# Altium project Task_2.PrjPcb (part 2 of 5)
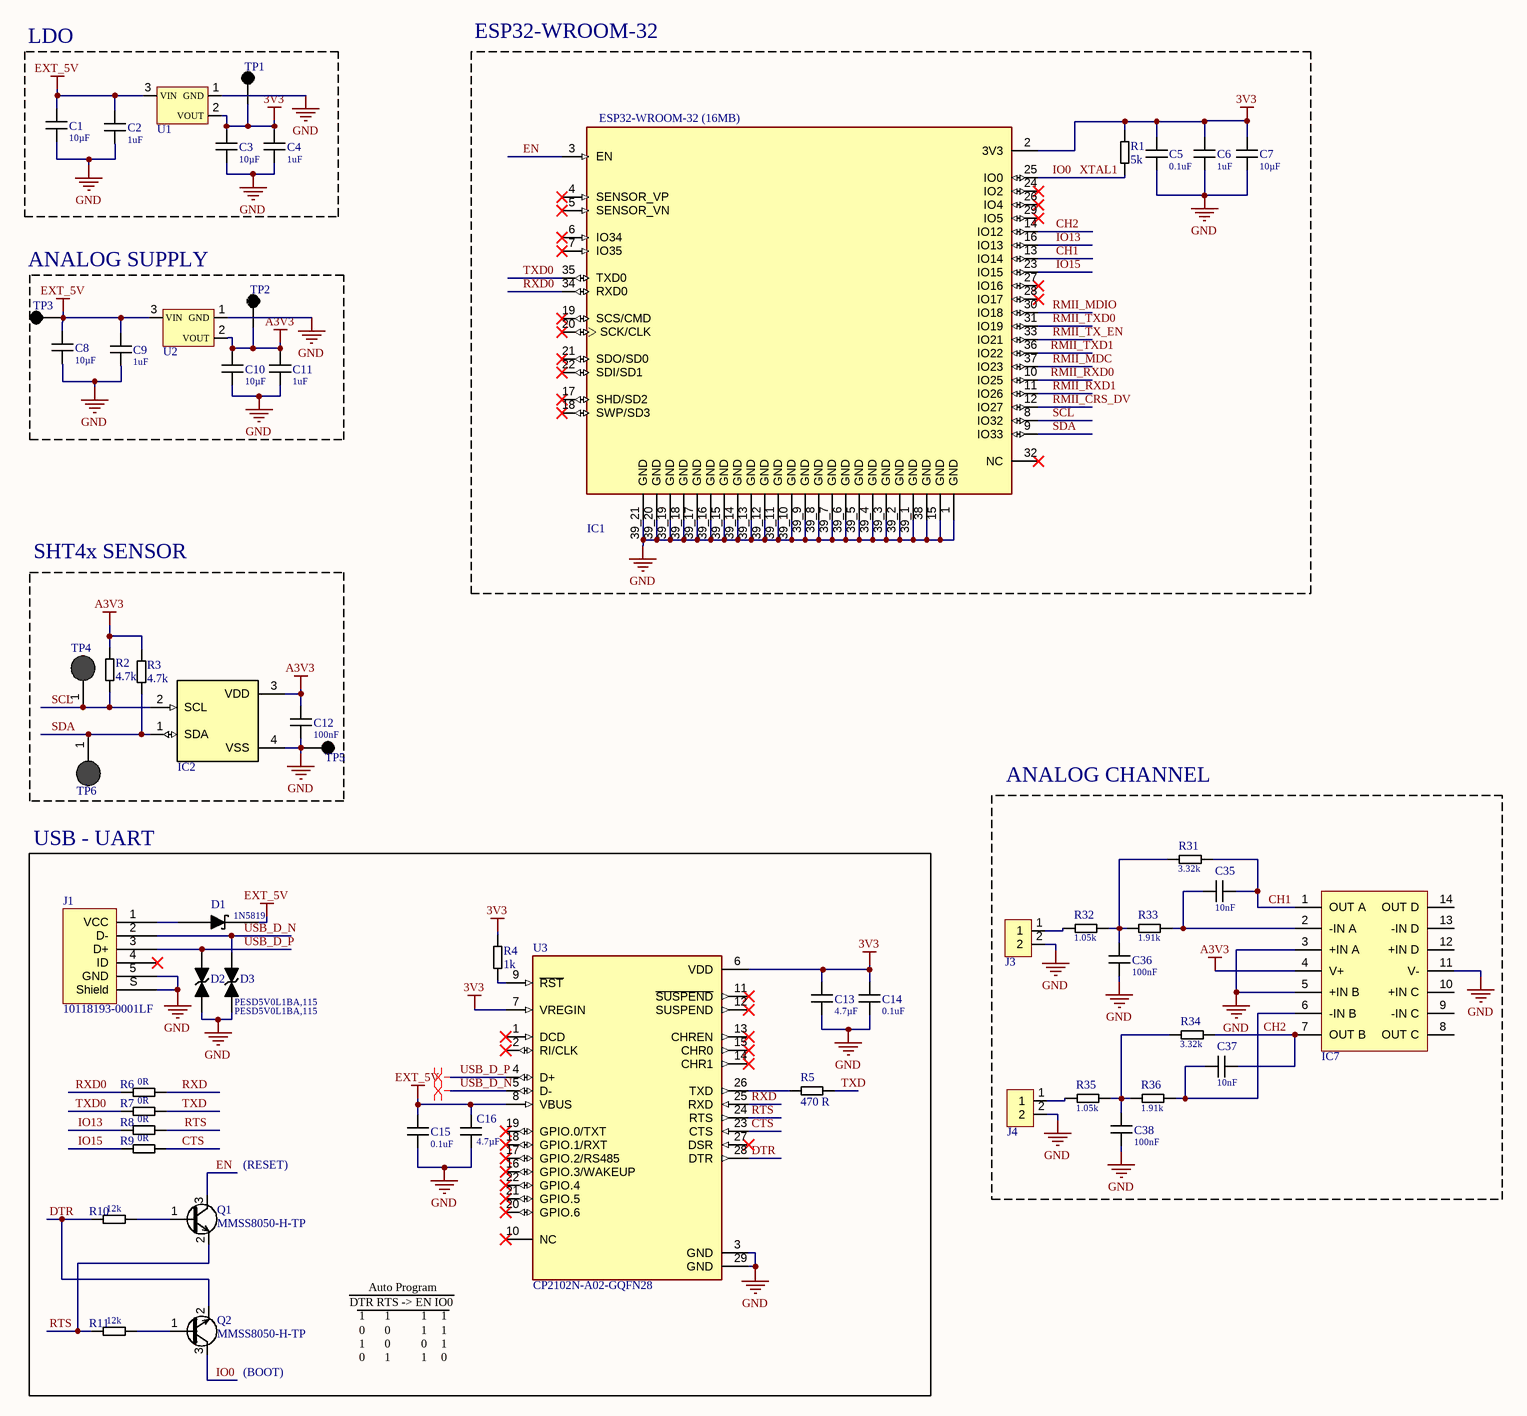
[diagram p2: Sheet1.SchDoc]

## Sheet Sheet1.SchDoc (continued)
### Library data of the parts
C1 C3 C7 C8 C10 = CAP 10uF 0603: Cap Ceramic 10uF ±%10 SMD 0603; Manufacturer: Yageo Group; Dielectric: X5R; Tolerance: 10%; Voltage Rating: 10V; Supplier 1: Farnell; Manufacturer Part Number: CC0603KRX5R6BB106; RoHS: Compliant; Category: Ceramic Capacitors; Stock 1: 32000; Pricing 1: 4000=0,0373 (EUR); Case/Package: 0603; Case Code (Imperial): 0603; Case Code (Metric): 1608; China RoHS: Compliant; Composition: Ceramic; Depth: 800µm; Dielectric Material: Ceramic; Halogen Free: Halogen Free; Height: 800µm; Lead Free: Lead Free; Length: 1.6mm; Lifecycle Status: Production; Material: Ceramic; Max Operating Temperature: 85°C; Min Operating Temperature: -55°C; Mount: Surface Mount; Number of Pins: 2; Number of Terminals: 2; Packaging: Cut Tape (CT); REACH SVHC: Yes; Schedule B: 8532240020, 8532240020|8532240020|8532240020|8532240020|8532240020; Termination: SMD/SMT; Thickness: 889µm; Voltage Rating (DC): 10V; Weight: 2.012816mg; Width: 800µm; ComponentLink1URL: https://datasheet.octopart.com:443/CC0603KRX5R6BB106-Yageo-datasheet-170350636.pdf?src-supplier=IHS; ComponentLink1Description: https://datasheet.octopart.com:443/CC0603KRX5R6BB106-Yageo-datasheet-170350636.pdf?src-supplier=IHS; ComponentLink2URL: https://datasheet.octopart.com:443/CC0603KRX5R6BB106-Yageo-datasheet-145016144.pdf?src-supplier=ODG+(Origin+Data+Global); ComponentLink2Description: https://datasheet.octopart.com:443/CC0603KRX5R6BB106-Yageo-datasheet-145016144.pdf?src-supplier=ODG+(Origin+Data+Global); ComponentLink3URL: https://sigma.octopart.com:443/147830939/technical_drawing/Yageo-CC0603KRX5R6BB106.pdf?src-supplier=Upverter; ComponentLink3Description: https://sigma.octopart.com:443/147830939/technical_drawing/Yageo-CC0603KRX5R6BB106.pdf?src-supplier=Upverter; ComponentLink4URL: https://datasheet.octopart.com:443/CC0603KRX5R6BB106-Yageo-Group-datasheet-189192896.pdf?src-supplier=TME; ComponentLink4Description: https://datasheet.octopart.com:443/CC0603KRX5R6BB106-Yageo-Group-datasheet-189192896.pdf?src-supplier=TME; ComponentLink5URL: https://datasheet.octopart.com:443/CC0603KRX5R6BB106-Yageo-datasheet-181968515.pdf?src-supplier=Farnell; ComponentLink5Description: https://datasheet.octopart.com:443/CC0603KRX5R6BB106-Yageo-datasheet-181968515.pdf?src-supplier=Farnell; ComponentLink6URL: https://datasheet.octopart.com:443/CC0603KRX5R6BB106-Yageo-Group-datasheet-184398209.pdf?src-supplier=Farnell; ComponentLink6Description: https://datasheet.octopart.com:443/CC0603KRX5R6BB106-Yageo-Group-datasheet-184398209.pdf?src-supplier=Farnell; ComponentLink7URL: https://datasheet.octopart.com:443/CC0603KRX5R6BB106-Yageo-Group-datasheet-175963154.pdf?src-supplier=Newark; ComponentLink7Description: https://datasheet.octopart.com:443/CC0603KRX5R6BB106-Yageo-Group-datasheet-175963154.pdf?src-supplier=Newark; ComponentLink8URL: https://datasheet.octopart.com:443/CC0603KRX5R6BB106-Yageo-datasheet-158238148.pdf?src-supplier=Newark; ComponentLink8Description: https://datasheet.octopart.com:443/CC0603KRX5R6BB106-Yageo-datasheet-158238148.pdf?src-supplier=Newark; ComponentLink9URL: https://datasheet.octopart.com:443/CC0603KRX5R6BB106-Yageo-datasheet-137875056.pdf?src-supplier=Future+Electronics; ComponentLink9Description: https://datasheet.octopart.com:443/CC0603KRX5R6BB106-Yageo-datasheet-137875056.pdf?src-supplier=Future+Electronics; ComponentLink10URL: https://datasheet.octopart.com:443/CC0603KRX5R6BB106-Yageo-datasheet-78855687.pdf?src-supplier=Future+Electronics; ComponentLink10Description: https://datasheet.octopart.com:443/CC0603KRX5R6BB106-Yageo-datasheet-78855687.pdf?src-supplier=Future+Electronics; ComponentLink11URL: https://datasheet.octopart.com:443/CC0603KRX5R6BB106-Yageo-datasheet-62067349.pdf?src-supplier=Future+Electronics; ComponentLink11Description: https://datasheet.octopart.com:443/CC0603KRX5R6BB106-Yageo-datasheet-62067349.pdf?src-supplier=Future+Electronics; ComponentLink12URL: https://datasheet.octopart.com:443/CC0603KRX5R6BB106-Yageo-datasheet-68071816.pdf?src-supplier=Future+Electronics; ComponentLink12Description: https://datasheet.octopart.com:443/CC0603KRX5R6BB106-Yageo-datasheet-68071816.pdf?src-supplier=Future+Electronics; ComponentLink13URL: https://datasheet.octopart.com:443/CC0603KRX5R6BB106-Yageo-datasheet-68297942.pdf?src-supplier=Future+Electronics; ComponentLink13Description: https://datasheet.octopart.com:443/CC0603KRX5R6BB106-Yageo-datasheet-68297942.pdf?src-supplier=Future+Electronics; ComponentLink14URL: https://datasheet.octopart.com/CC0603KRX5R6BB106-Yageo-datasheet-86397281.pdf; ComponentLink14Description: https://datasheet.octopart.com/CC0603KRX5R6BB106-Yageo-datasheet-86397281.pdf; ComponentLink15URL: http://sigma.octopart.com:80/rohs_statement/Yageo-company-2.pdf?src-supplier=Compliance+Statements; ComponentLink15Description: http://sigma.octopart.com:80/rohs_statement/Yageo-company-2.pdf?src-supplier=Compliance+Statements; ComponentLink16URL: http://sigma.octopart.com:80/conflict_mineral_statement/Yageo-company-3.pdf?src-supplier=Compliance+Statements; ComponentLink16Description: http://sigma.octopart.com:80/conflict_mineral_statement/Yageo-company-3.pdf?src-supplier=Compliance+Statements; Supplier Part Number 1: 3759761
C2 C4 C6 C9 C11 = CAP 1uF 0603: Cap Ceramic 1 µF  10 V ±%10 SMD 0603; Manufacturer: KEMET; Manufacturer Part Number: C0603C104K8RACTU; Dielectric: X7R; Dissipation Factor: 5%; Temperature Coefficient: 30ppm/°C; Tolerance: 10%; Voltage: 10V; Supplier 1: Farnell; RoHS: Compliant; Category: Ceramic Capacitors; Stock 1: 76000; Pricing 1: 4000=0,0182 (EUR); Case/Package: 0603; Case Code (Imperial): 0603; China RoHS: Compliant; Contact Plating: Tin; Depth: 800µm; Dielectric Material: Ceramic; Height: 800µm; Lead Free: Lead Free; Lead Pitch: 700µm; Length: 1.6mm; Lifecycle Status: Production; Material: Ceramic; Max Operating Temperature: 125°C; Min Operating Temperature: -55°C; Mount: Surface Mount; Number of Pins: 2; Number of Terminals: 2; Packaging: Tape & Reel; Radiation Hardening: No; REACH SVHC: Yes; Schedule B: 8532240020, 8532240020|8532240020, 8532240020|8532240020|8532240020, 8532240020|8532240020|8532240020|8532240020; Termination: SMD/SMT; Thickness: 863.6µm; Voltage Rating: 10V; Voltage Rating (DC): 10V; Width: 800µm; ComponentLink1URL: https://datasheet.octopart.com:443/C0603C104K8RAC7867-KEMET-datasheet-179096319.pdf?src-supplier=IHS; ComponentLink1Description: https://datasheet.octopart.com:443/C0603C104K8RAC7867-KEMET-datasheet-179096319.pdf?src-supplier=IHS; ComponentLink2URL: https://datasheet.octopart.com:443/C0603C104K8RACTU-KEMET-datasheet-178445679.pdf?src-supplier=IHS; ComponentLink2Description: https://datasheet.octopart.com:443/C0603C104K8RACTU-KEMET-datasheet-178445679.pdf?src-supplier=IHS; ComponentLink3URL: https://datasheet.octopart.com:443/C0603C104K8RACTU-KEMET-datasheet-137357759.pdf?src-supplier=Farnell; ComponentLink3Description: https://datasheet.octopart.com:443/C0603C104K8RACTU-KEMET-datasheet-137357759.pdf?src-supplier=Farnell; ComponentLink4URL: https://datasheet.octopart.com:443/C0603C104K8RACTU-KEMET-datasheet-149521868.pdf?src-supplier=Farnell; ComponentLink4Description: https://datasheet.octopart.com:443/C0603C104K8RACTU-KEMET-datasheet-149521868.pdf?src-supplier=Farnell; ComponentLink5URL: https://datasheet.octopart.com:443/C0603C104K8RACTU-KEMET-datasheet-101575656.pdf?src-supplier=Farnell; ComponentLink5Description: https://datasheet.octopart.com:443/C0603C104K8RACTU-KEMET-datasheet-101575656.pdf?src-supplier=Farnell; ComponentLink6URL: https://datasheet.octopart.com:443/C0603C104K8RACTU-KEMET-datasheet-137357764.pdf?src-supplier=Upverter; ComponentLink6Description: https://datasheet.octopart.com:443/C0603C104K8RACTU-KEMET-datasheet-137357764.pdf?src-supplier=Upverter; ComponentLink7URL: https://datasheet.octopart.com:443/C0603C104K8RAC7867-KEMET-datasheet-188512054.pdf?src-supplier=ODG+(Origin+Data+Global); ComponentLink7Description: https://datasheet.octopart.com:443/C0603C104K8RAC7867-KEMET-datasheet-188512054.pdf?src-supplier=ODG+(Origin+Data+Global); ComponentLink8URL: https://datasheet.octopart.com:443/C0603C104K8RACTU-Kemet-datasheet-32036385.pdf?src-supplier=Electro+Sonic; ComponentLink8Description: https://datasheet.octopart.com:443/C0603C104K8RACTU-Kemet-datasheet-32036385.pdf?src-supplier=Electro+Sonic; ComponentLink9URL: https://datasheet.octopart.com:443/C0603C104K8RACTU-KEMET-datasheet-157246124.pdf?src-supplier=Electro+Sonic; ComponentLink9Description: https://datasheet.octopart.com:443/C0603C104K8RACTU-KEMET-datasheet-157246124.pdf?src-supplier=Electro+Sonic; ComponentLink10URL: https://datasheet.octopart.com:443/C0603C104K8RACTU-Kemet-datasheet-12608295.pdf?src-supplier=element14+APAC; ComponentLink10Description: https://datasheet.octopart.com:443/C0603C104K8RACTU-Kemet-datasheet-12608295.pdf?src-supplier=element14+APAC; ComponentLink11URL: https://datasheet.octopart.com:443/C0603C104K8RACTU-Kemet-datasheet-11992184.pdf?src-supplier=element14+APAC; ComponentLink11Description: https://datasheet.octopart.com:443/C0603C104K8RACTU-Kemet-datasheet-11992184.pdf?src-supplier=element14+APAC; ComponentLink12URL: https://datasheet.octopart.com:443/C0603C104K8RACTU-Kemet-datasheet-10942409.pdf?src-supplier=element14+APAC; ComponentLink12Description: https://datasheet.octopart.com:443/C0603C104K8RACTU-Kemet-datasheet-10942409.pdf?src-supplier=element14+APAC; ComponentLink13URL: https://datasheet.octopart.com:443/C0603C104K8RACTU-Kemet-datasheet-10404442.pdf?src-supplier=element14+APAC; ComponentLink13Description: https://datasheet.octopart.com:443/C0603C104K8RACTU-Kemet-datasheet-10404442.pdf?src-supplier=element14+APAC; ComponentLink14URL: https://datasheet.octopart.com:443/C0603C104K8RACTU-Kemet-datasheet-21133259.pdf?src-supplier=element14+APAC; ComponentLink14Description: https://datasheet.octopart.com:443/C0603C104K8RACTU-Kemet-datasheet-21133259.pdf?src-supplier=element14+APAC; ComponentLink15URL: https://datasheet.octopart.com:443/C0603C104K8RACTU-Kemet-datasheet-41232427.pdf?src-supplier=element14+APAC; ComponentLink15Description: https://datasheet.octopart.com:443/C0603C104K8RACTU-Kemet-datasheet-41232427.pdf?src-supplier=element14+APAC; ComponentLink16URL: https://datasheet.octopart.com:443/C0603C104K8RACTU-Kemet-datasheet-5313890.pdf?src-supplier=element14; ComponentLink16Description: https://datasheet.octopart.com:443/C0603C104K8RACTU-Kemet-datasheet-5313890.pdf?src-supplier=element14; ComponentLink17URL: https://datasheet.octopart.com:443/C0603C104K8RACTU-KEMET-datasheet-176142238.pdf?src-supplier=Newark; ComponentLink17Description: https://datasheet.octopart.com:443/C0603C104K8RACTU-KEMET-datasheet-176142238.pdf?src-supplier=Newark; ComponentLink18URL: https://datasheet.octopart.com:443/C0603C104K8RACTU-Kemet-datasheet-27203261.pdf?src-supplier=Newark; ComponentLink18Description: https://datasheet.octopart.com:443/C0603C104K8RACTU-Kemet-datasheet-27203261.pdf?src-supplier=Newark; ComponentLink19URL: https://datasheet.octopart.com:443/C0603C104K8RACTU-KEMET-datasheet-164512540.pdf?src-supplier=TME; ComponentLink19Description: https://datasheet.octopart.com:443/C0603C104K8RACTU-KEMET-datasheet-164512540.pdf?src-supplier=TME; ComponentLink20URL: https://datasheet.octopart.com:443/C0603C104K8RACTU-KEMET-datasheet-96931493.pdf?src-supplier=TME; ComponentLink20Description: https://datasheet.octopart.com:443/C0603C104K8RACTU-KEMET-datasheet-96931493.pdf?src-supplier=TME; ComponentLink21URL: https://datasheet.octopart.com:443/C0603C104K8RACTU-KEMET-datasheet-68331906.pdf?src-supplier=TME; ComponentLink21Description: https://datasheet.octopart.com:443/C0603C104K8RACTU-KEMET-datasheet-68331906.pdf?src-supplier=TME; ComponentLink22URL: https://datasheet.octopart.com:443/C0603C104K8RACTU-KEMET-datasheet-110724412.pdf?src-supplier=RS+(Formerly+Allied+Electronics); ComponentLink22Description: https://datasheet.octopart.com:443/C0603C104K8RACTU-KEMET-datasheet-110724412.pdf?src-supplier=RS+(Formerly+Allied+Electronics); ComponentLink23URL: https://datasheet.octopart.com:443/C0603C104K8RACTU-Kemet-datasheet-464.pdf?src-supplier=RS+(Formerly+Allied+Electronics); ComponentLink23Description: https://datasheet.octopart.com:443/C0603C104K8RACTU-Kemet-datasheet-464.pdf?src-supplier=RS+(Formerly+Allied+Electronics); ComponentLink24URL: https://datasheet.octopart.com/C0603C104K8RACTU-KEMET-datasheet-84169754.pdf; ComponentLink24Description: https://datasheet.octopart.com/C0603C104K8RACTU-KEMET-datasheet-84169754.pdf; ComponentLink25URL: https://datasheet.octopart.com:443/C0603C104K8RAC-TU-Kemet-datasheet-8204392.pdf?src-supplier=Jameco; ComponentLink25Description: https://datasheet.octopart.com:443/C0603C104K8RAC-TU-Kemet-datasheet-8204392.pdf?src-supplier=Jameco; Supplier Part Number 1: 2665559; Supplier 2: Farnell; Stock 2: 521260; Pricing 2: 10=0,0345, 100=0,0249, 500=0,0211, 1000=0,0197, 2000=0,0187, 4000=0,0173 (EUR); Case Code (Metric): 1608; Composition: Ceramic; Halogen Free: Halogen Free; Voltage Rating (AC): 10V; ComponentLink26URL: https://datasheet.octopart.com:443/CC0603KRX5R6BB105-Yageo-datasheet-170350636.pdf?src-supplier=IHS; ComponentLink26Description: https://datasheet.octopart.com:443/CC0603KRX5R6BB105-Yageo-datasheet-170350636.pdf?src-supplier=IHS; ComponentLink27URL: https://datasheet.octopart.com:443/CC0603KRX5R6BB105-Yageo-datasheet-82288757.pdf?src-supplier=Upverter; ComponentLink27Description: https://datasheet.octopart.com:443/CC0603KRX5R6BB105-Yageo-datasheet-82288757.pdf?src-supplier=Upverter; ComponentLink28URL: https://datasheet.octopart.com:443/CC0603KRX5R6BB105-Yageo-datasheet-8324442.pdf?src-supplier=element14+APAC; ComponentLink28Description: https://datasheet.octopart.com:443/CC0603KRX5R6BB105-Yageo-datasheet-8324442.pdf?src-supplier=element14+APAC; ComponentLink29URL: https://datasheet.octopart.com:443/CC0603KRX5R6BB105-Yageo-datasheet-181968512.pdf?src-supplier=Newark; ComponentLink29Description: https://datasheet.octopart.com:443/CC0603KRX5R6BB105-Yageo-datasheet-181968512.pdf?src-supplier=Newark; ComponentLink30URL: https://datasheet.octopart.com:443/CC0603KRX5R6BB105-Yageo-datasheet-10911834.pdf?src-supplier=Newark; ComponentLink30Description: https://datasheet.octopart.com:443/CC0603KRX5R6BB105-Yageo-datasheet-10911834.pdf?src-supplier=Newark; ComponentLink31URL: https://datasheet.octopart.com:443/CC0603KRX5R6BB105-Yageo-datasheet-62067349.pdf?src-supplier=Newark; ComponentLink31Description: https://datasheet.octopart.com:443/CC0603KRX5R6BB105-Yageo-datasheet-62067349.pdf?src-supplier=Newark; ComponentLink32URL: https://datasheet.octopart.com:443/CC0603KRX5R6BB105-Yageo-datasheet-158238148.pdf?src-supplier=Newark; ComponentLink32Description: https://datasheet.octopart.com:443/CC0603KRX5R6BB105-Yageo-datasheet-158238148.pdf?src-supplier=Newark; ComponentLink33URL: https://datasheet.octopart.com/CC0603KRX5R6BB105-Yageo-datasheet-86397281.pdf; ComponentLink33Description: https://datasheet.octopart.com/CC0603KRX5R6BB105-Yageo-datasheet-86397281.pdf; ComponentLink34URL: https://datasheet.octopart.com:443/CC0603KRX5R6BB105-Phycomp-datasheet-519481.pdf?src-supplier=element14; ComponentLink34Description: https://datasheet.octopart.com:443/CC0603KRX5R6BB105-Phycomp-datasheet-519481.pdf?src-supplier=element14; ComponentLink35URL: https://datasheet.octopart.com:443/CC0603KRX5R6BB105-Yageo-datasheet-8701639.pdf?src-supplier=element14; ComponentLink35Description: https://datasheet.octopart.com:443/CC0603KRX5R6BB105-Yageo-datasheet-8701639.pdf?src-supplier=element14; ComponentLink36URL: https://datasheet.octopart.com:443/CC0603KRX5R6BB105-Yageo-Group-datasheet-184398209.pdf?src-supplier=Farnell; ComponentLink36Description: https://datasheet.octopart.com:443/CC0603KRX5R6BB105-Yageo-Group-datasheet-184398209.pdf?src-supplier=Farnell; ComponentLink37URL: https://datasheet.octopart.com:443/CC0603KRX5R6BB105-Phycomp-datasheet-8359971.pdf?src-supplier=Farnell; ComponentLink37Description: https://datasheet.octopart.com:443/CC0603KRX5R6BB105-Phycomp-datasheet-8359971.pdf?src-supplier=Farnell; ComponentLink38URL: https://datasheet.octopart.com:443/CC0603KRX5R6BB105-Phycomp-datasheet-500777.pdf?src-supplier=Farnell; ComponentLink38Description: https://datasheet.octopart.com:443/CC0603KRX5R6BB105-Phycomp-datasheet-500777.pdf?src-supplier=Farnell; ComponentLink39URL: https://datasheet.octopart.com:443/CC0603KRX5R6BB105-Yageo-datasheet-175963154.pdf?src-supplier=JRH+Electronics; ComponentLink39Description: https://datasheet.octopart.com:443/CC0603KRX5R6BB105-Yageo-datasheet-175963154.pdf?src-supplier=JRH+Electronics; ComponentLink40URL: https://datasheet.octopart.com:443/CC0603KRX5R6BB105-Yageo-datasheet-149070021.pdf?src-supplier=TME; ComponentLink40Description: https://datasheet.octopart.com:443/CC0603KRX5R6BB105-Yageo-datasheet-149070021.pdf?src-supplier=TME; ComponentLink41URL: https://datasheet.octopart.com:443/CC0603KRX5R6BB105-Yageo-Group-datasheet-145016144.pdf?src-supplier=ODG+(Origin+Data+Global); ComponentLink41Description: https://datasheet.octopart.com:443/CC0603KRX5R6BB105-Yageo-Group-datasheet-145016144.pdf?src-supplier=ODG+(Origin+Data+Global); ComponentLink42URL: https://datasheet.octopart.com:443/CC0603KRX5R6BB105-Yageo-datasheet-137875056.pdf?src-supplier=Future+Electronics; ComponentLink42Description: https://datasheet.octopart.com:443/CC0603KRX5R6BB105-Yageo-datasheet-137875056.pdf?src-supplier=Future+Electronics; ComponentLink43URL: https://datasheet.octopart.com:443/CC0603KRX5R6BB105-Yageo-datasheet-137700082.pdf?src-supplier=Future+Electronics; ComponentLink43Description: https://datasheet.octopart.com:443/CC0603KRX5R6BB105-Yageo-datasheet-137700082.pdf?src-supplier=Future+Electronics; ComponentLink44URL: https://datasheet.octopart.com:443/CC0603KRX5R6BB105-Yageo-datasheet-137700085.pdf?src-supplier=Future+Electronics; ComponentLink44Description: https://datasheet.octopart.com:443/CC0603KRX5R6BB105-Yageo-datasheet-137700085.pdf?src-supplier=Future+Electronics; ComponentLink45URL: https://datasheet.octopart.com:443/CC0603KRX5R6BB105-Yageo-datasheet-59875459.pdf?src-supplier=Future+Electronics; ComponentLink45Description: https://datasheet.octopart.com:443/CC0603KRX5R6BB105-Yageo-datasheet-59875459.pdf?src-supplier=Future+Electronics; ComponentLink46URL: https://datasheet.octopart.com:443/CC0603KRX5R6BB105-Yageo-datasheet-27626583.pdf?src-supplier=Future+Electronics; ComponentLink46Description: https://datasheet.octopart.com:443/CC0603KRX5R6BB105-Yageo-datasheet-27626583.pdf?src-supplier=Future+Electronics; ComponentLink47URL: https://datasheet.octopart.com:443/CC0603KRX5R6BB105-Yageo-datasheet-15895757.pdf?src-supplier=Future+Electronics; ComponentLink47Description: https://datasheet.octopart.com:443/CC0603KRX5R6BB105-Yageo-datasheet-15895757.pdf?src-supplier=Future+Electronics; ComponentLink48URL: https://datasheet.octopart.com:443/CC0603KRX5R6BB105-Yageo-datasheet-14389981.pdf?src-supplier=Future+Electronics; ComponentLink48Description: https://datasheet.octopart.com:443/CC0603KRX5R6BB105-Yageo-datasheet-14389981.pdf?src-supplier=Future+Electronics; ComponentLink49URL: http://sigma.octopart.com:80/rohs_statement/Yageo-company-2.pdf?src-supplier=Compliance+Statements; ComponentLink49Description: http://sigma.octopart.com:80/rohs_statement/Yageo-company-2.pdf?src-supplier=Compliance+Statements; ComponentLink50URL: http://sigma.octopart.com:80/conflict_mineral_statement/Yageo-company-3.pdf?src-supplier=Compliance+Statements; ComponentLink50Description: http://sigma.octopart.com:80/conflict_mineral_statement/Yageo-company-3.pdf?src-supplier=Compliance+Statements; Supplier Part Number 2: 9402080
C5 C14 C15 = CAP 0.1uF 0603: Cap Ceramic 0.1uF ±%10 10V SMD 0603; Manufacturer: KEMET; Dielectric: X7R; Dissipation Factor: 5%; Temperature Coefficient: 30ppm/°C; Tolerance: 10%; Supplier 1: Farnell; Manufacturer Part Number: C0603C104K8RACTU; RoHS: Compliant; Category: Ceramic Capacitors; Stock 1: 76000; Pricing 1: 4000=0,0182 (EUR); Case/Package: 0603; Case Code (Imperial): 0603; China RoHS: Compliant; Contact Plating: Tin; Depth: 800µm; Dielectric Material: Ceramic; Height: 800µm; Lead Free: Lead Free; Lead Pitch: 700µm; Length: 1.6mm; Lifecycle Status: Production; Material: Ceramic; Max Operating Temperature: 125°C; Min Operating Temperature: -55°C; Mount: Surface Mount; Number of Pins: 2; Number of Terminals: 2; Packaging: Tape & Reel; Radiation Hardening: No; REACH SVHC: Yes; Schedule B: 8532240020, 8532240020|8532240020, 8532240020|8532240020|8532240020, 8532240020|8532240020|8532240020|8532240020; Termination: SMD/SMT; Thickness: 863.6µm; Voltage: 10V; Voltage Rating: 10V; Voltage Rating (DC): 10V; Width: 800µm; ComponentLink1URL: https://datasheet.octopart.com:443/C0603C104K8RAC7867-KEMET-datasheet-179096319.pdf?src-supplier=IHS; ComponentLink1Description: https://datasheet.octopart.com:443/C0603C104K8RAC7867-KEMET-datasheet-179096319.pdf?src-supplier=IHS; ComponentLink2URL: https://datasheet.octopart.com:443/C0603C104K8RACTU-KEMET-datasheet-178445679.pdf?src-supplier=IHS; ComponentLink2Description: https://datasheet.octopart.com:443/C0603C104K8RACTU-KEMET-datasheet-178445679.pdf?src-supplier=IHS; ComponentLink3URL: https://datasheet.octopart.com:443/C0603C104K8RACTU-KEMET-datasheet-137357759.pdf?src-supplier=Farnell; ComponentLink3Description: https://datasheet.octopart.com:443/C0603C104K8RACTU-KEMET-datasheet-137357759.pdf?src-supplier=Farnell; ComponentLink4URL: https://datasheet.octopart.com:443/C0603C104K8RACTU-KEMET-datasheet-149521868.pdf?src-supplier=Farnell; ComponentLink4Description: https://datasheet.octopart.com:443/C0603C104K8RACTU-KEMET-datasheet-149521868.pdf?src-supplier=Farnell; ComponentLink5URL: https://datasheet.octopart.com:443/C0603C104K8RACTU-KEMET-datasheet-101575656.pdf?src-supplier=Farnell; ComponentLink5Description: https://datasheet.octopart.com:443/C0603C104K8RACTU-KEMET-datasheet-101575656.pdf?src-supplier=Farnell; ComponentLink6URL: https://datasheet.octopart.com:443/C0603C104K8RACTU-KEMET-datasheet-137357764.pdf?src-supplier=Upverter; ComponentLink6Description: https://datasheet.octopart.com:443/C0603C104K8RACTU-KEMET-datasheet-137357764.pdf?src-supplier=Upverter; ComponentLink7URL: https://datasheet.octopart.com:443/C0603C104K8RAC7867-KEMET-datasheet-188512054.pdf?src-supplier=ODG+(Origin+Data+Global); ComponentLink7Description: https://datasheet.octopart.com:443/C0603C104K8RAC7867-KEMET-datasheet-188512054.pdf?src-supplier=ODG+(Origin+Data+Global); ComponentLink8URL: https://datasheet.octopart.com:443/C0603C104K8RACTU-Kemet-datasheet-32036385.pdf?src-supplier=Electro+Sonic; ComponentLink8Description: https://datasheet.octopart.com:443/C0603C104K8RACTU-Kemet-datasheet-32036385.pdf?src-supplier=Electro+Sonic; ComponentLink9URL: https://datasheet.octopart.com:443/C0603C104K8RACTU-KEMET-datasheet-157246124.pdf?src-supplier=Electro+Sonic; ComponentLink9Description: https://datasheet.octopart.com:443/C0603C104K8RACTU-KEMET-datasheet-157246124.pdf?src-supplier=Electro+Sonic; ComponentLink10URL: https://datasheet.octopart.com:443/C0603C104K8RACTU-Kemet-datasheet-12608295.pdf?src-supplier=element14+APAC; ComponentLink10Description: https://datasheet.octopart.com:443/C0603C104K8RACTU-Kemet-datasheet-12608295.pdf?src-supplier=element14+APAC; ComponentLink11URL: https://datasheet.octopart.com:443/C0603C104K8RACTU-Kemet-datasheet-11992184.pdf?src-supplier=element14+APAC; ComponentLink11Description: https://datasheet.octopart.com:443/C0603C104K8RACTU-Kemet-datasheet-11992184.pdf?src-supplier=element14+APAC; ComponentLink12URL: https://datasheet.octopart.com:443/C0603C104K8RACTU-Kemet-datasheet-10942409.pdf?src-supplier=element14+APAC; ComponentLink12Description: https://datasheet.octopart.com:443/C0603C104K8RACTU-Kemet-datasheet-10942409.pdf?src-supplier=element14+APAC; ComponentLink13URL: https://datasheet.octopart.com:443/C0603C104K8RACTU-Kemet-datasheet-10404442.pdf?src-supplier=element14+APAC; ComponentLink13Description: https://datasheet.octopart.com:443/C0603C104K8RACTU-Kemet-datasheet-10404442.pdf?src-supplier=element14+APAC; ComponentLink14URL: https://datasheet.octopart.com:443/C0603C104K8RACTU-Kemet-datasheet-21133259.pdf?src-supplier=element14+APAC; ComponentLink14Description: https://datasheet.octopart.com:443/C0603C104K8RACTU-Kemet-datasheet-21133259.pdf?src-supplier=element14+APAC; ComponentLink15URL: https://datasheet.octopart.com:443/C0603C104K8RACTU-Kemet-datasheet-41232427.pdf?src-supplier=element14+APAC; ComponentLink15Description: https://datasheet.octopart.com:443/C0603C104K8RACTU-Kemet-datasheet-41232427.pdf?src-supplier=element14+APAC; ComponentLink16URL: https://datasheet.octopart.com:443/C0603C104K8RACTU-Kemet-datasheet-5313890.pdf?src-supplier=element14; ComponentLink16Description: https://datasheet.octopart.com:443/C0603C104K8RACTU-Kemet-datasheet-5313890.pdf?src-supplier=element14; ComponentLink17URL: https://datasheet.octopart.com:443/C0603C104K8RACTU-KEMET-datasheet-176142238.pdf?src-supplier=Newark; ComponentLink17Description: https://datasheet.octopart.com:443/C0603C104K8RACTU-KEMET-datasheet-176142238.pdf?src-supplier=Newark; ComponentLink18URL: https://datasheet.octopart.com:443/C0603C104K8RACTU-Kemet-datasheet-27203261.pdf?src-supplier=Newark; ComponentLink18Description: https://datasheet.octopart.com:443/C0603C104K8RACTU-Kemet-datasheet-27203261.pdf?src-supplier=Newark; ComponentLink19URL: https://datasheet.octopart.com:443/C0603C104K8RACTU-KEMET-datasheet-164512540.pdf?src-supplier=TME; ComponentLink19Description: https://datasheet.octopart.com:443/C0603C104K8RACTU-KEMET-datasheet-164512540.pdf?src-supplier=TME; ComponentLink20URL: https://datasheet.octopart.com:443/C0603C104K8RACTU-KEMET-datasheet-96931493.pdf?src-supplier=TME; ComponentLink20Description: https://datasheet.octopart.com:443/C0603C104K8RACTU-KEMET-datasheet-96931493.pdf?src-supplier=TME; ComponentLink21URL: https://datasheet.octopart.com:443/C0603C104K8RACTU-KEMET-datasheet-68331906.pdf?src-supplier=TME; ComponentLink21Description: https://datasheet.octopart.com:443/C0603C104K8RACTU-KEMET-datasheet-68331906.pdf?src-supplier=TME; ComponentLink22URL: https://datasheet.octopart.com:443/C0603C104K8RACTU-KEMET-datasheet-110724412.pdf?src-supplier=RS+(Formerly+Allied+Electronics); ComponentLink22Description: https://datasheet.octopart.com:443/C0603C104K8RACTU-KEMET-datasheet-110724412.pdf?src-supplier=RS+(Formerly+Allied+Electronics); ComponentLink23URL: https://datasheet.octopart.com:443/C0603C104K8RACTU-Kemet-datasheet-464.pdf?src-supplier=RS+(Formerly+Allied+Electronics); ComponentLink23Description: https://datasheet.octopart.com:443/C0603C104K8RACTU-Kemet-datasheet-464.pdf?src-supplier=RS+(Formerly+Allied+Electronics); ComponentLink24URL: https://datasheet.octopart.com/C0603C104K8RACTU-KEMET-datasheet-84169754.pdf; ComponentLink24Description: https://datasheet.octopart.com/C0603C104K8RACTU-KEMET-datasheet-84169754.pdf; ComponentLink25URL: https://datasheet.octopart.com:443/C0603C104K8RAC-TU-Kemet-datasheet-8204392.pdf?src-supplier=Jameco; ComponentLink25Description: https://datasheet.octopart.com:443/C0603C104K8RAC-TU-Kemet-datasheet-8204392.pdf?src-supplier=Jameco; Supplier Part Number 1: 2665559
C12 C36 C38 = CAP 100nF 0603: Cap Ceramic 100nF ±%20 SMD 0603; Manufacturer: KEMET; Manufacturer Part Number: C0603C104M5RACTU; Tolerance: 20%; Dielectric: X7R; Voltage Rating (DC): 50V; Dissipation Factor: 2.5%; Designed by: Semih AŞÇI; Supplier 1: Digi-Key; RoHS: Yes; Category: Ceramic Capacitors; Stock 1: 6121004; Pricing 1: 1=0,10000, 10=0,03400, 50=0,01840, 100=0,01510, 500=0,01078, 1000=0,00847 (USD); Mount: Surface Mount,PCB; Case/Package: 0603; Case Code (Metric): 1608; Case Code (Imperial): 0603; Dielectric Material: Ceramic; Contact Plating: Tin,Matte; Min Operating Temperature: -55°C; Max Operating Temperature: 125°C; Package Quantity: 1; Packaging: Tape and Reel; Termination: SMD/SMT; Voltage Rating: 50V; Length: 1.6mm; Width: 0.031inch; Height: 0.8mm; Thickness: 0.034inch; Lead Pitch: 0.7mm; Depth: 0.8mm; Radiation Hardening: No; REACH SVHC: No SVHC; ComponentLink1URL: http://www.alliedelec.com/m/d/6f3b5eb83d09db50ed28bdc730567b33.pdf?src-supplier=Allied+Electronics; ComponentLink1Description: http://www.alliedelec.com/m/d/6f3b5eb83d09db50ed28bdc730567b33.pdf?src-supplier=Allied+Electronics; ComponentLink2URL: http://www.mouser.com/ds/2/212/KEM_C1002_X7R_SMD-1102033.pdf?src-supplier=Mouser; ComponentLink2Description: http://www.mouser.com/ds/2/212/KEM_C1002_X7R_SMD-1102033.pdf?src-supplier=Mouser; ComponentLink3URL: https://www.verical.com/server-webapp/html/getDatasheet?partID=626892&src-supplier=Verical; ComponentLink3Description: https://www.verical.com/server-webapp/html/getDatasheet?partID=626892&src-supplier=Verical; ComponentLink4URL: http://www.farnell.com/datasheets/2746056.pdf?src-supplier=Farnell; ComponentLink4Description: http://www.farnell.com/datasheets/2746056.pdf?src-supplier=Farnell; ComponentLink5URL: http://components.arrow.com/part/dataview/40911037S8853915N7429?src-supplier=Arrow+Electronics; ComponentLink5Description: http://components.arrow.com/part/dataview/40911037S8853915N7429?src-supplier=Arrow+Electronics; ComponentLink6URL: http://components.arrow.com/part/dataview/0323_00313986?src-supplier=Arrow+Europe; ComponentLink6Description: http://components.arrow.com/part/dataview/0323_00313986?src-supplier=Arrow+Europe; ComponentLink7URL: http://www.farnell.com/datasheets/2315113.pdf?src-supplier=Newark; ComponentLink7Description: http://www.farnell.com/datasheets/2315113.pdf?src-supplier=Newark; ComponentLink8URL: https://api.kemet.com/component-edge/download/datasheet/C0603C104M5RACTU.pdf?src-supplier=Digi-Key; ComponentLink8Description: https://api.kemet.com/component-edge/download/datasheet/C0603C104M5RACTU.pdf?src-supplier=Digi-Key; ComponentLink9URL: https://www.verical.com/server-webapp/html/getDatasheet?partID=110138&src-supplier=Verical; ComponentLink9Description: https://www.verical.com/server-webapp/html/getDatasheet?partID=110138&src-supplier=Verical; ComponentLink10URL: http://www.farnell.com/datasheets/2746056.pdf?src-supplier=Newark; ComponentLink10Description: http://www.farnell.com/datasheets/2746056.pdf?src-supplier=Newark; ComponentLink11URL: http://www.farnell.com/datasheets/2746056.pdf?src-supplier=Element14; ComponentLink11Description: http://www.farnell.com/datasheets/2746056.pdf?src-supplier=Element14; ComponentLink12URL: http://capacitoredge.kemet.com/capedge2/DataSheet?pn=C0603C104M5RAC7867&src-supplier=Avnet+Asia; ComponentLink12Description: http://capacitoredge.kemet.com/capedge2/DataSheet?pn=C0603C104M5RAC7867&src-supplier=Avnet+Asia; ComponentLink13URL: http://capacitoredge.kemet.com/capedge2/DataSheet?pn=C0603C104M5RAC7867&src-supplier=Avnet; ComponentLink13Description: http://capacitoredge.kemet.com/capedge2/DataSheet?pn=C0603C104M5RAC7867&src-supplier=Avnet; ComponentLink14URL: http://www.farnell.com/datasheets/1828800.pdf?src-supplier=Newark; ComponentLink14Description: http://www.farnell.com/datasheets/1828800.pdf?src-supplier=Newark; Supplier Part Number 1: 399-C0603C104M5RAC7867CT-ND
C13 C16 = CAP 4.7uF 0603: Cap Ceramic 4.7uF ±%10  10V SMD 0603; Manufacturer: Yageo Group; Manufacturer Part Number: CC0603KRX5R6BB475; Dielectric: X5R; Tolerance: 10%; Supplier 1: Farnell; RoHS: Compliant; Category: Ceramic Capacitors; Stock 1: 140000; Pricing 1: 4000=0,0354 (EUR); Case/Package: 0603; Case Code (Imperial): 0603; Case Code (Metric): 1608; China RoHS: Compliant; Composition: Ceramic; Depth: 800µm; Dielectric Material: Ceramic; Halogen Free: Halogen Free; Height: 800µm; Lead Free: Lead Free; Length: 1.6mm; Lifecycle Status: Production; Material: Ceramic; Max Operating Temperature: 85°C; Min Operating Temperature: -55°C; Mount: Surface Mount; Number of Pins: 2; Number of Terminals: 2; Radiation Hardening: No; REACH SVHC: Yes; Schedule B: 8532240020, 8532240020|8532240020|8532240020|8532240020|8532240020; Termination: SMD/SMT; Thickness: 889µm; Voltage Rating: 10V; Voltage Rating (DC): 10V; Width: 800µm; ComponentLink1URL: https://datasheet.octopart.com:443/CC0603KRX5R6BB475-Yageo-datasheet-170350636.pdf?src-supplier=IHS; ComponentLink1Description: https://datasheet.octopart.com:443/CC0603KRX5R6BB475-Yageo-datasheet-170350636.pdf?src-supplier=IHS; ComponentLink2URL: https://datasheet.octopart.com/CC0603KRX5R6BB475-Yageo-datasheet-86397281.pdf; ComponentLink2Description: https://datasheet.octopart.com/CC0603KRX5R6BB475-Yageo-datasheet-86397281.pdf; ComponentLink3URL: https://datasheet.octopart.com:443/CC0603KRX5R6BB475-Yageo-datasheet-82288757.pdf?src-supplier=Upverter; ComponentLink3Description: https://datasheet.octopart.com:443/CC0603KRX5R6BB475-Yageo-datasheet-82288757.pdf?src-supplier=Upverter; ComponentLink4URL: https://datasheet.octopart.com:443/CC0603KRX5R6BB475-Yageo-datasheet-10911834.pdf?src-supplier=element14+APAC; ComponentLink4Description: https://datasheet.octopart.com:443/CC0603KRX5R6BB475-Yageo-datasheet-10911834.pdf?src-supplier=element14+APAC; ComponentLink5URL: https://datasheet.octopart.com:443/CC0603KRX5R6BB475-Yageo-datasheet-62067349.pdf?src-supplier=element14+APAC; ComponentLink5Description: https://datasheet.octopart.com:443/CC0603KRX5R6BB475-Yageo-datasheet-62067349.pdf?src-supplier=element14+APAC; ComponentLink6URL: https://datasheet.octopart.com:443/CC0603KRX5R6BB475-Yageo-datasheet-181968526.pdf?src-supplier=Farnell; ComponentLink6Description: https://datasheet.octopart.com:443/CC0603KRX5R6BB475-Yageo-datasheet-181968526.pdf?src-supplier=Farnell; ComponentLink7URL: https://datasheet.octopart.com:443/CC0603KRX5R6BB475-Phycomp-datasheet-519481.pdf?src-supplier=Farnell; ComponentLink7Description: https://datasheet.octopart.com:443/CC0603KRX5R6BB475-Phycomp-datasheet-519481.pdf?src-supplier=Farnell; ComponentLink8URL: https://datasheet.octopart.com:443/CC0603KRX5R6BB475-Yageo-datasheet-158238148.pdf?src-supplier=Newark; ComponentLink8Description: https://datasheet.octopart.com:443/CC0603KRX5R6BB475-Yageo-datasheet-158238148.pdf?src-supplier=Newark; ComponentLink9URL: https://datasheet.octopart.com:443/CC0603KRX5R6BB475-Yageo-datasheet-8324442.pdf?src-supplier=Newark; ComponentLink9Description: https://datasheet.octopart.com:443/CC0603KRX5R6BB475-Yageo-datasheet-8324442.pdf?src-supplier=Newark; ComponentLink10URL: https://datasheet.octopart.com:443/CC0603KRX5R6BB475-Yageo-datasheet-149070021.pdf?src-supplier=TME; ComponentLink10Description: https://datasheet.octopart.com:443/CC0603KRX5R6BB475-Yageo-datasheet-149070021.pdf?src-supplier=TME; ComponentLink11URL: https://datasheet.octopart.com:443/CC0603KRX5R6BB475-Yageo-Group-datasheet-145016144.pdf?src-supplier=ODG+(Origin+Data+Global); ComponentLink11Description: https://datasheet.octopart.com:443/CC0603KRX5R6BB475-Yageo-Group-datasheet-145016144.pdf?src-supplier=ODG+(Origin+Data+Global); ComponentLink12URL: https://datasheet.octopart.com:443/CC0603KRX5R6BB475-Yageo-datasheet-137875056.pdf?src-supplier=Future+Electronics; ComponentLink12Description: https://datasheet.octopart.com:443/CC0603KRX5R6BB475-Yageo-datasheet-137875056.pdf?src-supplier=Future+Electronics; ComponentLink13URL: https://datasheet.octopart.com:443/CC0603KRX5R6BB475-Yageo-datasheet-137700082.pdf?src-supplier=Future+Electronics; ComponentLink13Description: https://datasheet.octopart.com:443/CC0603KRX5R6BB475-Yageo-datasheet-137700082.pdf?src-supplier=Future+Electronics; ComponentLink14URL: https://datasheet.octopart.com:443/CC0603KRX5R6BB475-Yageo-datasheet-137700085.pdf?src-supplier=Future+Electronics; ComponentLink14Description: https://datasheet.octopart.com:443/CC0603KRX5R6BB475-Yageo-datasheet-137700085.pdf?src-supplier=Future+Electronics; ComponentLink15URL: https://datasheet.octopart.com:443/CC0603KRX5R6BB475-Yageo-datasheet-59875459.pdf?src-supplier=Future+Electronics; ComponentLink15Description: https://datasheet.octopart.com:443/CC0603KRX5R6BB475-Yageo-datasheet-59875459.pdf?src-supplier=Future+Electronics; ComponentLink16URL: https://datasheet.octopart.com:443/CC0603KRX5R6BB475-Yageo-datasheet-27626583.pdf?src-supplier=Future+Electronics; ComponentLink16Description: https://datasheet.octopart.com:443/CC0603KRX5R6BB475-Yageo-datasheet-27626583.pdf?src-supplier=Future+Electronics; ComponentLink17URL: https://datasheet.octopart.com:443/CC0603KRX5R6BB475-Yageo-datasheet-15895757.pdf?src-supplier=Future+Electronics; ComponentLink17Description: https://datasheet.octopart.com:443/CC0603KRX5R6BB475-Yageo-datasheet-15895757.pdf?src-supplier=Future+Electronics; ComponentLink18URL: https://datasheet.octopart.com:443/CC0603KRX5R6BB475-Yageo-datasheet-14389981.pdf?src-supplier=Future+Electronics; ComponentLink18Description: https://datasheet.octopart.com:443/CC0603KRX5R6BB475-Yageo-datasheet-14389981.pdf?src-supplier=Future+Electronics; ComponentLink19URL: http://sigma.octopart.com:80/rohs_statement/Yageo-company-2.pdf?src-supplier=Compliance+Statements; ComponentLink19Description: http://sigma.octopart.com:80/rohs_statement/Yageo-company-2.pdf?src-supplier=Compliance+Statements; ComponentLink20URL: http://sigma.octopart.com:80/conflict_mineral_statement/Yageo-company-3.pdf?src-supplier=Compliance+Statements; ComponentLink20Description: http://sigma.octopart.com:80/conflict_mineral_statement/Yageo-company-3.pdf?src-supplier=Compliance+Statements; Supplier Part Number 1: 3871732
C35 C37 = CAP 10nF 0603: Cap Ceramic 10nF ±%10 SMD 0603; Manufacturer: Walsin Technologies; Tolerance: 10%; Dielectric: X7R; Voltage Rating: 16V; Designed by: Semih AŞÇI; Supplier 1: Digi-Key; Manufacturer Part Number: 0603B103K160CT; RoHS: Yes; Category: Ceramic Capacitors; Stock 1: 4117; Pricing 1: 1=0,10000, 10=0,03600, 50=0,01980, 100=0,01620, 500=0,01156, 1000=0,00908 (USD); Case/Package: 0603; Case Code (Metric): 1608; Case Code (Imperial): 0603; Min Operating Temperature: -55°C; Max Operating Temperature: 125°C; Packaging: Tape and Reel; Voltage Rating (DC): 16V; Length: 1.6mm; Depth: 0.8mm; REACH SVHC: Unknown; RoHS Compliant: Yes; ComponentLink1URL: http://www.farnell.com/datasheets/1958513.pdf?src-supplier=Farnell; ComponentLink1Description: http://www.farnell.com/datasheets/1958513.pdf?src-supplier=Farnell; ComponentLink2URL: http://components.arrow.com/part/dataview/0323_00656382?src-supplier=Arrow+Europe; ComponentLink2Description: http://components.arrow.com/part/dataview/0323_00656382?src-supplier=Arrow+Europe; ComponentLink3URL: http://www.farnell.com/datasheets/1958513.pdf?src-supplier=Element14; ComponentLink3Description: http://www.farnell.com/datasheets/1958513.pdf?src-supplier=Element14; ComponentLink4URL: http://www.passivecomponent.com/wp-content/uploads/2018/10/MLCC.pdf?src-supplier=Digi-Key; ComponentLink4Description: http://www.passivecomponent.com/wp-content/uploads/2018/10/MLCC.pdf?src-supplier=Digi-Key; Supplier Part Number 1: 1292-1384-1-ND
D1 = 1N5819WS TWS: Rectifier Diode, Schottky, 1 Phase, 1 Element, 1A, 40V V(RRM), Silicon; Manufacturer: Diodes; Manufacturer Part Number: 1N5819HW-7-F; Max Forward Surge Current (Ifsm): 25A; Polarity: Standard; Forward Voltage: 450mV; Max Reverse Current: 50uA; Value: 50pF; Max Power Dissipation: 450mW; Designed by: Semih AŞÇI; Supplier: Future Electronics; Supplier Part Number: 5349287; RoHS: Yes; Category: Rectifier Diodes; Stock: 4902000; Pricing: 3000=0,0473, 9000=0,0456, 15000=0,0448, 60000=0,0427, 90000=0,0414 (USD); Case/Package: SOD-123-2; Pins: 2; Weight: 0.000353oz; Min Operating Temperature: -65°C; Max Operating Temperature: 125°C; Packaging: Tape and Reel; Average Rectified Current: 1A; Voltage Rating (DC): 40V; Current Rating: 1A; Output Current: 1A; Max Reverse Voltage (DC): 40V; Series: -; Package Quantity: 3000; Forward Current: 1A; Max Repetitive Reverse Voltage (Vrrm): 40V; Peak Non-Repetitive Surge Current: 25A; Reverse Voltage: 40V; Termination: SMD/SMT; Length: 2.85mm; Width: 1.7mm; Height: 1.25mm; Radiation Hardening: No; Reach SVHC Compliant: No; Lead Free: Lead Free; RoHS Compliant: Yes
D2 D3 = PESD5V0L1BA: ESD protection diodes / TVS diodes; NEXPERIA; PESD5V0L1BA, 115; 33 V; 15 A; 5 V; 7.6 V; Manufacturer Lifecycle Status: RELEASED FOR SUPPLY; Breakdown Voltage: 7.6V; Capacitance: 75pF; Clamping Voltage: 33V; Direction: Bidirectional; Max Breakdown Voltage: 8.2V; Max Junction Temperature (Tj): 150°C; Min Breakdown Voltage: 7V; Number of Channels: 1; Operating Supply Voltage: 5V; Peak Pulse Current: 15A; Peak Pulse Power: 500W; Peak Reverse Current: 1µA; Supplier 1: Arrow Electronics; Manufacturer: Nexperia; Manufacturer Part Number: PESD5V0L1BA,115; RoHS: Compliant; Category: TVS Diodes; Stock 1: 426000; Pricing 1: 3000=0,0533, 6000=0,053, 9000=0,048, 24000=0,042 (USD); Ambient Temperature Range High: 150°C; China RoHS: Compliant; Contact Plating: Tin; Height: 1.1mm; Lifecycle Status: Production; Max Operating Temperature: 150°C; Min Operating Temperature: -65°C; Number of Elements: 1; Number of Pins: 2; Number of Terminals: 2; Polarity: Bidirectional; REACH SVHC: Yes; Reverse Standoff Voltage: 5V; Schedule B: 8541100050|8541100050|8541100050|8541100050|8541100050|8541100050|8541100050|8541100050|8541100050|8541100050|8541100050|8541100050|8541100050|8541100050|8541100050|8541100050|8541100050|8541100050|8541100050|8541100050|8541100050|8541100050|8541100050|85; ComponentLink1URL: https://datasheet.octopart.com:443/PESD5V0L1BA%2C115-Nexperia-datasheet-87844149.pdf?src-supplier=ODG+(Origin+Data+Global); ComponentLink1Description: https://datasheet.octopart.com:443/PESD5V0L1BA%2C115-Nexperia-datasheet-87844149.pdf?src-supplier=ODG+(Origin+Data+Global); ComponentLink2URL: https://datasheet.octopart.com:443/PESD5V0L1BA%2C115-Nexperia-datasheet-8526380.pdf?src-supplier=IHS; ComponentLink2Description: https://datasheet.octopart.com:443/PESD5V0L1BA%2C115-Nexperia-datasheet-8526380.pdf?src-supplier=IHS; ComponentLink3URL: https://datasheet.octopart.com:443/PESD5V0L1BA%2C115-Nexperia-datasheet-169158731.pdf?src-supplier=Future+Electronics; ComponentLink3Description: https://datasheet.octopart.com:443/PESD5V0L1BA%2C115-Nexperia-datasheet-169158731.pdf?src-supplier=Future+Electronics; ComponentLink4URL: https://datasheet.octopart.com:443/PESD5V0L1BA%2C115-Philips-datasheet-10228526.pdf?src-supplier=Future+Electronics; ComponentLink4Description: https://datasheet.octopart.com:443/PESD5V0L1BA%2C115-Philips-datasheet-10228526.pdf?src-supplier=Future+Electronics; ComponentLink5URL: https://datasheet.octopart.com:443/PESD5V0L1BA%2C115-Philips-datasheet-122853.pdf?src-supplier=Future+Electronics; ComponentLink5Description: https://datasheet.octopart.com:443/PESD5V0L1BA%2C115-Philips-datasheet-122853.pdf?src-supplier=Future+Electronics; ComponentLink6URL: https://datasheet.octopart.com:443/PESD5V0L1BA%2C115-Nexperia-datasheet-160639030.pdf?src-supplier=Newark; ComponentLink6Description: https://datasheet.octopart.com:443/PESD5V0L1BA%2C115-Nexperia-datasheet-160639030.pdf?src-supplier=Newark; ComponentLink7URL: https://sigma.octopart.com:443/138897194/technical_drawing/Nexperia-PESD5V0L1BA%2C115.pdf?src-supplier=Upverter; ComponentLink7Description: https://sigma.octopart.com:443/138897194/technical_drawing/Nexperia-PESD5V0L1BA%2C115.pdf?src-supplier=Upverter; ComponentLink8URL: http://sigma.octopart.com:80/rohs_statement/NXP-Semiconductors-company-12.pdf?src-supplier=Compliance+Statements; ComponentLink8Description: http://sigma.octopart.com:80/rohs_statement/NXP-Semiconductors-company-12.pdf?src-supplier=Compliance+Statements; ComponentLink9URL: http://sigma.octopart.com:80/reach_statement/NXP-Semiconductors-company-13.pdf?src-supplier=Compliance+Statements; ComponentLink9Description: http://sigma.octopart.com:80/reach_statement/NXP-Semiconductors-company-13.pdf?src-supplier=Compliance+Statements; Supplier Part Number 1: PESD5V0L1BA,115
IC1 = ESP32-WROOM-32(16MB): Wifi Module 128MBITS Spi Flash; Manufacturer: Espressif Systems; Designed by: Semih AŞÇI; Supplier 1: Digi-Key; Manufacturer Part Number: ESP32-WROOM-32 (16MB); RoHS: No; Category: RF Receivers, Transceivers; Pricing 1: 1=4,80000 (USD); ComponentLink1URL: https://www.espressif.com/sites/default/files/documentation/esp32-wroom-32_datasheet_en.pdf?src-supplier=Digi-Key; ComponentLink1Description: https://www.espressif.com/sites/default/files/documentation/esp32-wroom-32_datasheet_en.pdf?src-supplier=Digi-Key; Supplier Part Number 1: 1904-1020-6-ND
IC2 = SHT40: 1.8%RH/0.2C, 4TH Generation, Digital (I2C) Humidity And Temp; Manufacturer: Sensirion; Max Supply Voltage: 3.6V; Min Supply Voltage: 1.08V; Supplier 1: Mouser; Manufacturer Part Number: SHT40-BD1B-R2; RoHS: Compliant; Category: Temperature and Humidity Sensors; Stock 1: 3603; Pricing 1: 1=1,8, 10=1,4, 50=1,33, 100=1,27, 1000=1,14, 10000=1,07 (USD); Height: 500µm; Length: 1.5mm; Lifecycle Status: Production; Max Operating Temperature: 125°C; Min Operating Temperature: -40°C; Mount: Surface Mount; Number of Terminals: 4; REACH SVHC: Yes; ComponentLink1URL: https://datasheet.octopart.com:443/SHT40-BD1B-R2-Sensirion-datasheet-180736564.pdf?src-supplier=IHS; ComponentLink1Description: https://datasheet.octopart.com:443/SHT40-BD1B-R2-Sensirion-datasheet-180736564.pdf?src-supplier=IHS; ComponentLink2URL: https://datasheet.octopart.com:443/SHT40-BD1B-R2-Sensirion-datasheet-188431286.pdf?src-supplier=Newark; ComponentLink2Description: https://datasheet.octopart.com:443/SHT40-BD1B-R2-Sensirion-datasheet-188431286.pdf?src-supplier=Newark; ComponentLink3URL: https://datasheet.octopart.com:443/SHT40-BD1B-R2-Sensirion-datasheet-176402120.pdf?src-supplier=ODG+(Origin+Data+Global); ComponentLink3Description: https://datasheet.octopart.com:443/SHT40-BD1B-R2-Sensirion-datasheet-176402120.pdf?src-supplier=ODG+(Origin+Data+Global); Supplier Part Number 1: 403-SHT40-BD1B-R2
IC7 = OPA4187IPWR: Operational Amplifier 4 Channel 0.2V/us 36V Drift Rail-to-Rail Output 14-Pin TSSOP T/R; Manufacturer: Texas Instruments; Manufacturer Lifecycle Status: ACTIVE; Number of Channels: 4; Supplier 1: Arrow Electronics; Manufacturer Part Number: OPA4187IPWR; RoHS: Compliant; Category: Amplifiers - Op Amps, Buffer, Instrumentation; Stock 1: 2000; Pricing 1: 2000=2,124 (USD); Case/Package: TSSOP; Height: 0m; Length: 5mm; Lifecycle Status: Production; Number of Pins: 14; Thickness: 1mm; Width: 4.4mm; ComponentLink1URL: https://sigma.octopart.com:443/182471031/technical_drawing/Texas-Instruments-OPA4187IPWR.pdf?src-supplier=Texas+Instruments; ComponentLink1Description: https://sigma.octopart.com:443/182471031/technical_drawing/Texas-Instruments-OPA4187IPWR.pdf?src-supplier=Texas+Instruments; ComponentLink2URL: https://octopart.com:443/opatz8j6/c1?t=d8--WgdqNA6V-52D4_Q_Y4zGpz8yCJGkpe863AQujpZzbiubHLAO3h-0wT5EwqhoEmIhxOEyI5xhmfLK1T2AqbWwKnXxi6H7_ZTm7VmxINsflgJf1DhYxP-AsSyTG40-G5j3drOZ4YkSTdNRJiqqkp5KG8sJUb958jvXGFb6NBdetso0jDWB1k1YmtmkToUOP0JnT5IZoPlJXdP4zkihS4pFlqA__Jng0HsYaeJi9iWTZb0fT72fCSMEzDjP_GazxfkjihebNjpMoI5EDHlPuKNbjBduiVYn9zUmwmKyfp2eJAx6VfHPNP-hUlh5qUh144JynVLro-_kU7MSYKCskzLZbRfyVDMN_CLaG1EXXdGshL09sa8a2S-hLX-vH57-QBR5Qg&src-supplier=Texas+Instruments; ComponentLink2Description: https://octopart.com:443/opatz8j6/c1?t=d8--WgdqNA6V-52D4_Q_Y4zGpz8yCJGkpe863AQujpZzbiubHLAO3h-0wT5EwqhoEmIhxOEyI5xhmfLK1T2AqbWwKnXxi6H7_ZTm7VmxINsflgJf1DhYxP-AsSyTG40-G5j3drOZ4YkSTdNRJiqqkp5KG8sJUb958jvXGFb6NBdetso0jDWB1k1YmtmkToUOP0JnT5IZoPlJXdP4zkihS4pFlqA__Jng0HsYaeJi9iWTZb0fT72fCSMEzDjP_GazxfkjihebNjpMoI5EDHlPuKNbjBduiVYn9zUmwmKyfp2eJAx6VfHPNP-hUlh5qUh144JynVLro-_kU7MSYKCskzLZbRfyVDMN_CLaG1EXXdGshL09sa8a2S-hLX-vH57-QBR5Qg&src-supplier=Texas+Instruments; ComponentLink3URL: https://sigma.octopart.com:443/49249819/technical_drawing/Texas-Instruments-OPA4187IPWR.pdf?src-supplier=Texas+Instruments; ComponentLink3Description: https://sigma.octopart.com:443/49249819/technical_drawing/Texas-Instruments-OPA4187IPWR.pdf?src-supplier=Texas+Instruments; ComponentLink4URL: http://sigma.octopart.com:80/conflict_mineral_statement/Texas-Instruments-company-63.pdf?src-supplier=Compliance+Statements; ComponentLink4Description: http://sigma.octopart.com:80/conflict_mineral_statement/Texas-Instruments-company-63.pdf?src-supplier=Compliance+Statements; ComponentLink5URL: http://sigma.octopart.com:80/reach_statement/Texas-Instruments-company-64.pdf?src-supplier=Compliance+Statements; ComponentLink5Description: http://sigma.octopart.com:80/reach_statement/Texas-Instruments-company-64.pdf?src-supplier=Compliance+Statements; Supplier Part Number 1: OPA4187IPWR
J1 = 10118193-0001LF: CONN RCPT USB2.0 MICRO B SMD R/A; Manufacturer: Amphenol ICC (FCI); Connector Type: USB - micro B; Current Rating (Amps): 1.8A per Contact; Gender: Receptacle; Mating Cycles: 10000; Number of Contacts: 5; Number of Ports: 1; Shielding: Shielded; Voltage - Rated: 100VAC; Part Number: 10118193-0001LF; ComponentLink1Description: Datasheet; ComponentLink1URL: https://cdn.amphenol-icc.com/media/wysiwyg/files/documentation/datasheet/inputoutput/io_usb_micro.pdf; ComponentLink2Description: DigiKey Link; ComponentLink2URL: //digikey.com/product-detail/en/amphenol-icc-fci/10118193-0001LF/609-4616-2-ND/2785388; Features: Solder Retention; LastUpdated: 9.12.2019 20:51:28; Lifecycle Status: 0; Minimum Order: 1; Mounting Feature: Horizontal; Mounting Type: Surface Mount, Right Angle; Through Hole; Operating Temperature: -30°C ~ 80°C; Packaging: TapeAndReel; Part Status: Active; Price: 0.21; Series: -; Specifications: USB 2.0; Supplier 1: DigiKey; Supplier Part Number 1: 609-4616-2-ND; Termination: Solder